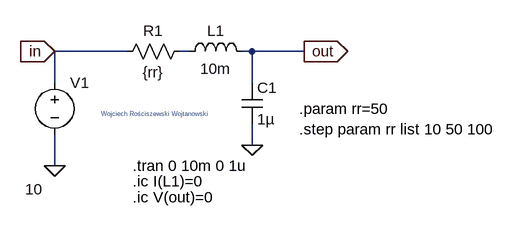
[diagram p0: schematic Charging a capacitor in an RLC Circuit change.asc]
Charging a capacitor in an RLC Circuit change.asc, the LTspice schematic file:
Version 4
SHEET 1 880 680
WIRE 208 32 96 32
WIRE 304 32 288 32
WIRE 400 32 384 32
WIRE 480 32 400 32
WIRE 96 80 96 32
WIRE 400 80 400 32
WIRE 400 176 400 144
WIRE 96 208 96 160
FLAG 96 208 0
FLAG 400 176 0
FLAG 480 32 out
IOPIN 480 32 Out
FLAG 96 32 in
IOPIN 96 32 In
SYMBOL voltage 96 64 R0
WINDOW 3 -45 180 Left 2
WINDOW 123 0 0 Left 0
WINDOW 39 0 0 Left 0
SYMATTR Value 10
SYMATTR InstName V1
SYMBOL res 304 16 R90
WINDOW 0 0 56 VBottom 2
WINDOW 3 32 56 VTop 2
SYMATTR InstName R1
SYMATTR Value {rr}
SYMBOL cap 384 80 R0
SYMATTR InstName C1
SYMATTR Value 1µ
SYMBOL ind 288 48 R270
WINDOW 0 32 56 VTop 2
WINDOW 3 5 56 VBottom 2
SYMATTR InstName L1
SYMATTR Value 10m
TEXT 216 208 Left 2 !.tran 0 10m 0 1u
TEXT 168 128 Left 0 ;Wojciech Rościszewski Wojtanowski
TEXT 216 232 Left 2 !.ic I(L1)=0
TEXT 216 256 Left 2 !.ic V(out)=0
TEXT 472 120 Left 2 !.param rr=50
TEXT 472 152 Left 2 !.step param rr list 10 50 100

The netlist it stands for:
* Charging a capacitor in an RLC Circuit change.asc
V1 in 0 10
R1 N001 in {rr}
C1 out 0 1µ
L1 N001 out 10m
.tran 0 10m 0 1u
* Wojciech Rościszewski Wojtanowski
.ic I(L1)=0
.ic V(out)=0
.param rr=50
.step param rr list 10 50 100
.backanno
.end